# EAGLE schematic lippert_carrier (EAGLE 5.11)
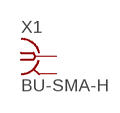
[diagram p0: schematic, sheet 1]

## Parts
X1  BU-SMA-H  [BU-SMA-H]
Unconnected: X1.1

## Power pins joined to a net without a drawn wire
GND: X1.2(GND) X1.3(GND) X1.4(GND) X1.5(GND)

## Library data of the parts
X1 = con-coax:BU-SMA-H: FEMALE SMA CONNECTOR Radiall; OC_FARNELL: unknown; OC_NEWARK: unknown